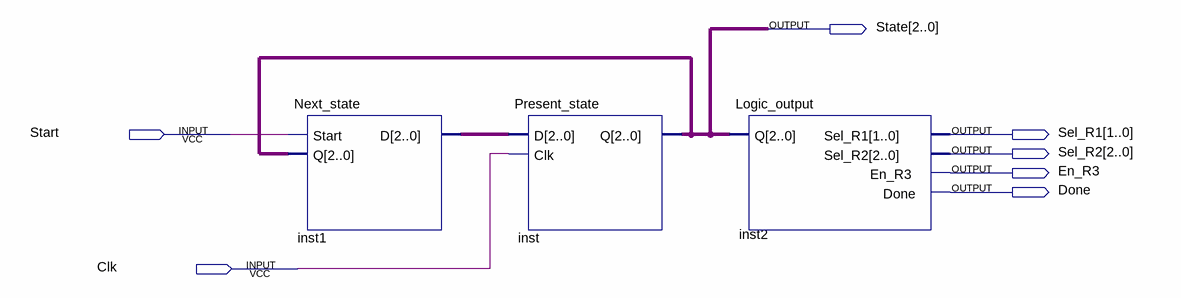
[diagram p0: schematic sheet]
// Quartus schematic Controller.bdf as structural Verilog: 3 symbols, 7 pins
module Controller (
  input  Start,
  input  Clk,
  output [2:0] State,
  output [1:0] Sel_R1,
  output [2:0] Sel_R2,
  output En_R3,
  output Done
);

  wire [2:0] inst1_d;

  Next_state inst1 (.Start(Start), .Q(State), .D(inst1_d));
  Present_state inst (.D(inst1_d), .Clk(Clk), .Q(State));
  Logic_output inst2 (.Q(State), .Sel_R1(Sel_R1), .Sel_R2(Sel_R2), .En_R3(En_R3), .Done(Done));
endmodule
